# EAGLE design booz_gps (EAGLE 5.04)
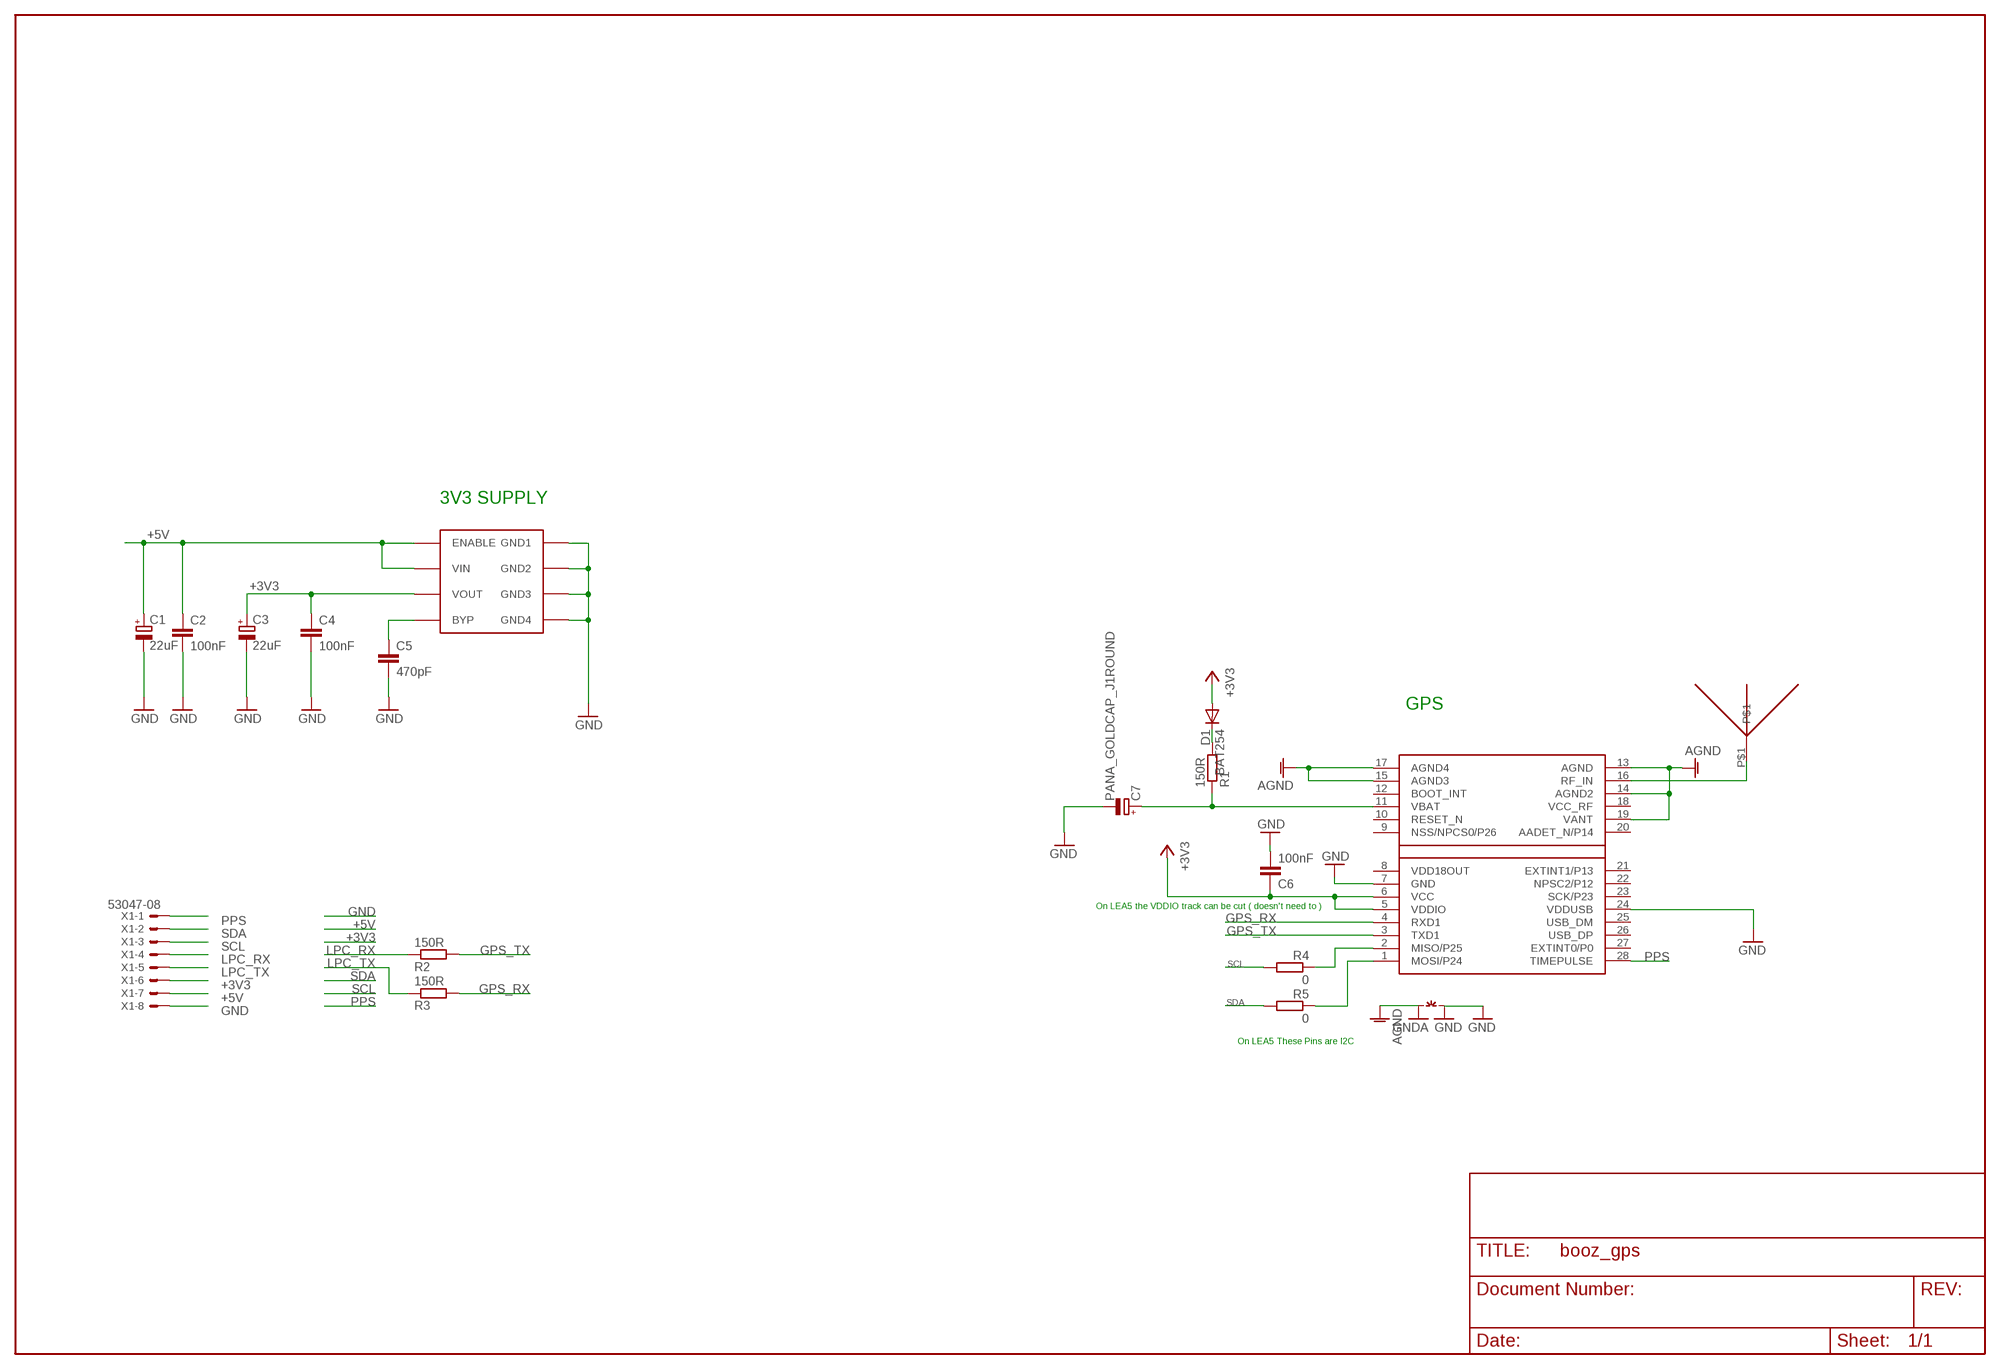
[diagram p0: schematic, sheet 1]

## Parts
ANT  GPS_PATCH_ANT  [SANGSHIN_1580MS18]
C1  22uF  CPOL-EUSMCB  [SMC_B]
C2  100nF  C-EUC0603  [C0603]
C3  22uF  CPOL-EUSMCB  [SMC_B]
C4  100nF  C-EUC0603K  [C0603K]
C5  470pF  C-EUC0603K  [C0603K]
C6  100nF  C-EUC0603K  [C0603K]
C7  PANA_GOLDCAP_J1ROUND  [PANA_J1_BIS]
D1  BAT254  DIODE-SOD110-R  [SOD110-R]
GPS  LEA-4P  [LEA-LA]
R1  150R  R-EU_R0603  [R0603]
R2  150R  R-EU_R0603  [R0603]
R3  150R  R-EU_R0603  [R0603]
R4  0  R-EU_R0603  [R0603]
R5  0  R-EU_R0603  [R0603]
VREG1  MIC5209  [SOIC8]
X1  53047-08  [53047-08]
~NUDEV~1  GND-GNDA  [GND-GNDA]

## Nets
+3V3: C3.+ C4.1 C6.1 D1.A GPS.5(VDDIO) GPS.6(VCC) VREG1.3(VOUT) X1.6
+5V: C1.+ C2.1 VREG1.1(ENABLE) VREG1.2(VIN) X1.7
AGND: GPS.13(AGND) GPS.14(AGND2) GPS.15(AGND3) GPS.17(AGND4) GPS.19(VANT) ~NUDEV~1.GNDA
GND: C1.- C2.2 C3.- C4.2 C5.2 C6.2 C7.MINUS(-) GPS.7(GND) GPS.24(VDDUSB) VREG1.5(GND4) VREG1.6(GND3) VREG1.7(GND2) VREG1.8(GND1) X1.8 ~NUDEV~1.GND
GPS_RX: GPS.4(RXD1) R3.2
GPS_TX: GPS.3(TXD1) R2.2
LPC_RX: R2.1 X1.4
LPC_TX: R3.1 X1.5
N$3: ANT.P$1 GPS.16(RF_IN)
N$6: C5.1 VREG1.4(BYP)
N$10: GPS.2(MISO/P25) R4.1
N$13: GPS.1(MOSI/P24) R5.1
N$28: C7.PLUS(+) GPS.11(VBAT) R1.1
N$29: D1.C R1.2
PPS: GPS.28(TIMEPULSE) X1.1
SCL: R4.2 X1.3
SDA: R5.2 X1.2
Unconnected: GPS.9(NSS/NPCS0/P26) GPS.10(RESET_N) GPS.12(BOOT_INT) GPS.20(AADET_N/P14) GPS.21(EXTINT1/P13) GPS.22(NPSC2/P12) GPS.23(SCK/P23) GPS.25(USB_DM) GPS.26(USB_DP) GPS.27(EXTINT0/P0)

## Notes on the sheet
- 3V3 SUPPLY
- GPS
- On LEA5 the VDDIO track can be cut ( doesn't need to )
- On LEA5 These Pins are I2C

## Power pins joined to a net without a drawn wire
VCC_RF: GPS.18(VCC_RF)
VDD18OUT: GPS.8(VDD18OUT)

## Library data of the parts
ANT = paparazzi:GPS_PATCH_ANT
C1 C3 = rcl:CPOL-EU: POLARIZED CAPACITOR, European symbol
C2 C4-C6 = rcl:C-EU: CAPACITOR, European symbol
C7 = paparazzi:PANA_GOLDCAP_J1
D1 = diode:DIODE-: DIODE
GPS = paparazzi:LEA-4P
R1-R5 = rcl:R-EU_: RESISTOR, European symbol
VREG1 = paparazzi:MIC5209
X1 = con-molex:53?-08: CONNECTOR wire to board 1.25 mm (.049 inch) pitch header
~NUDEV~1 = supply1:GND-GNDA: Example of GND--GNDA NET-Connetor for more info see description in package

## Board
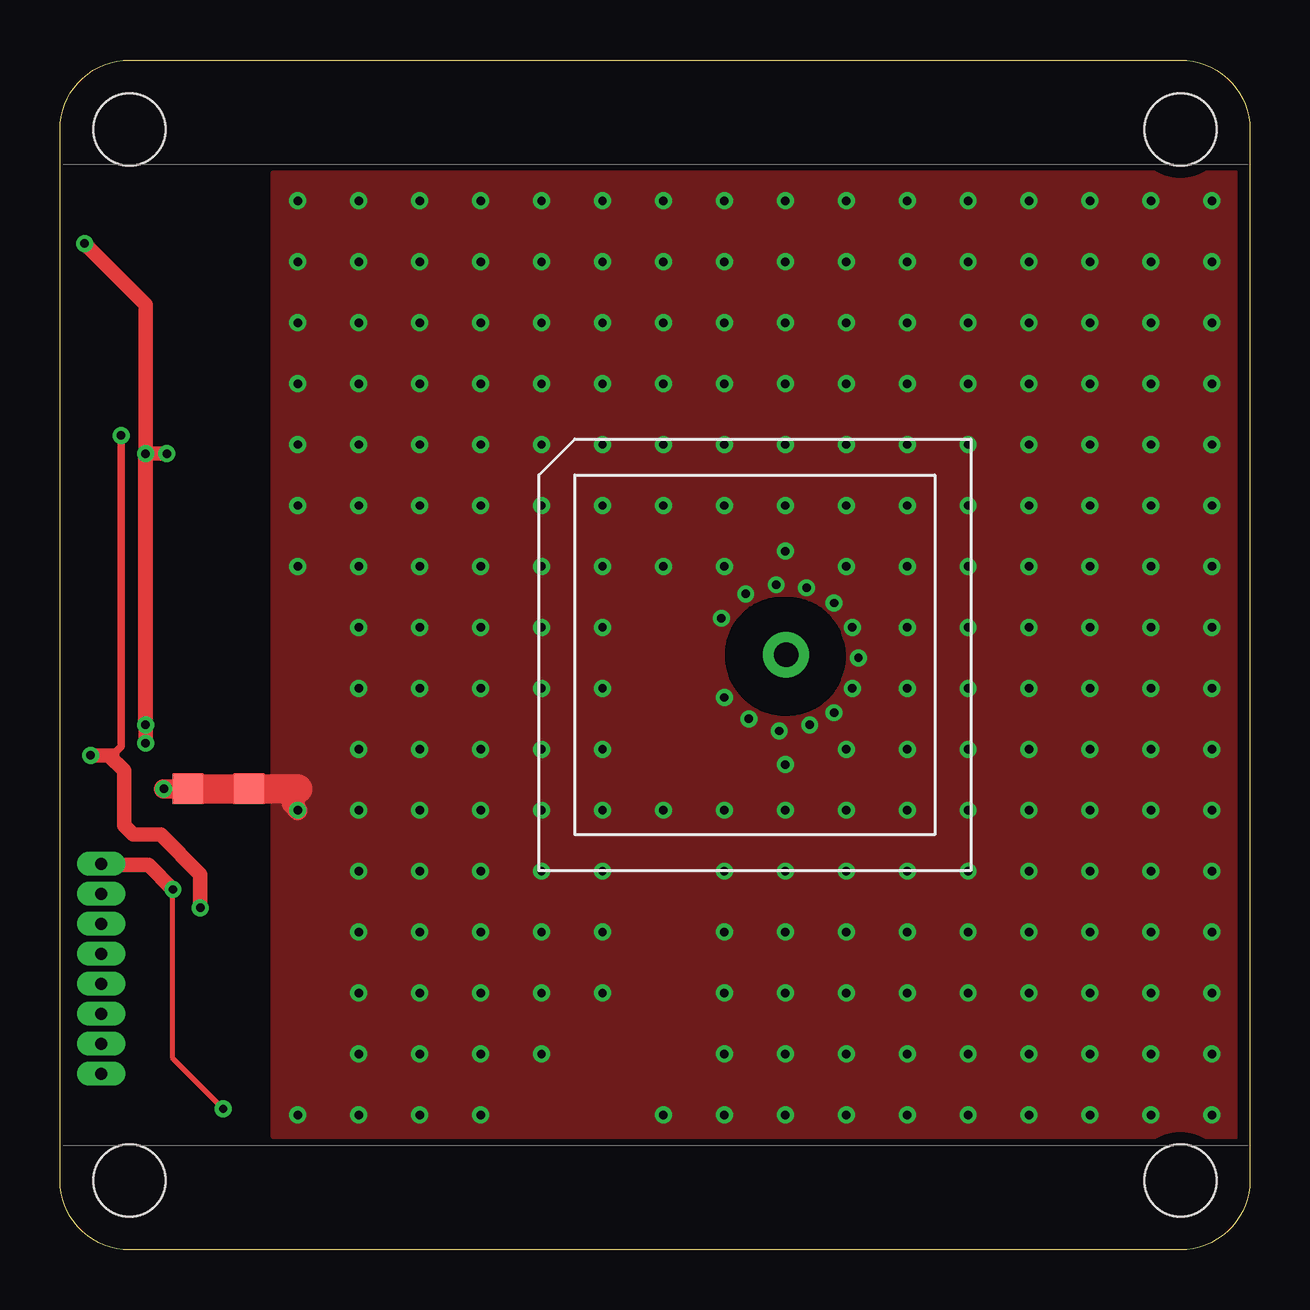
[diagram p1: board, top side]
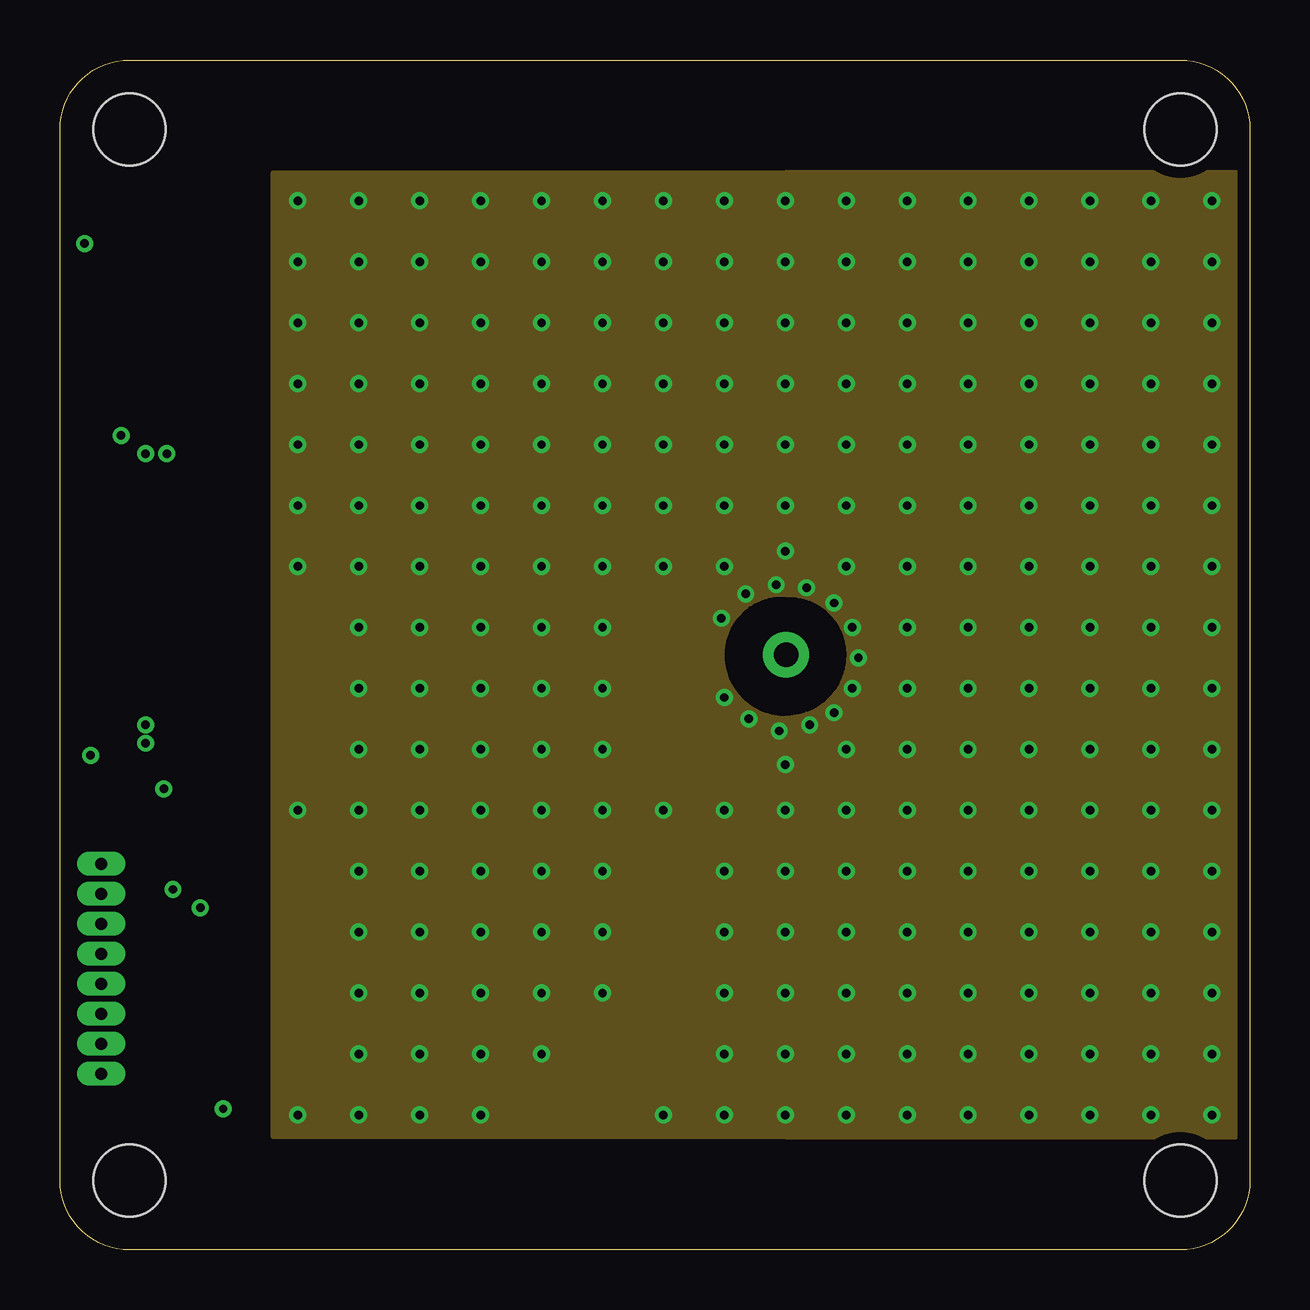
[diagram p2: board, inner layer Route2]
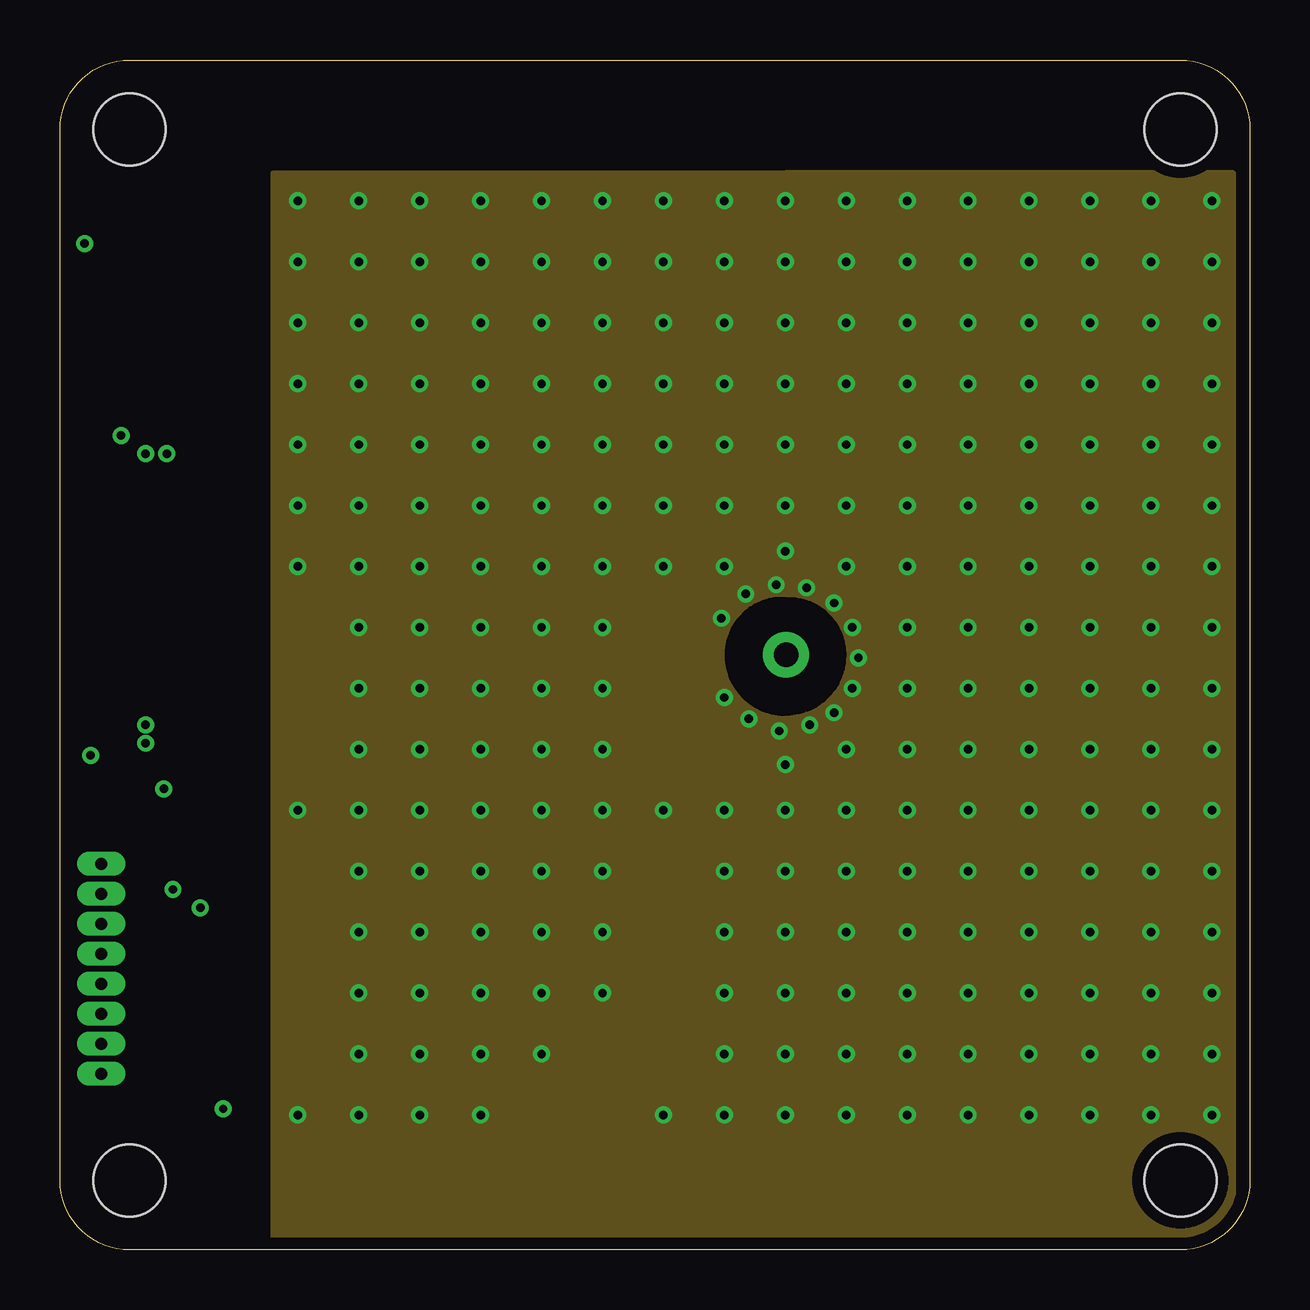
[diagram p3: board, inner layer Route15]
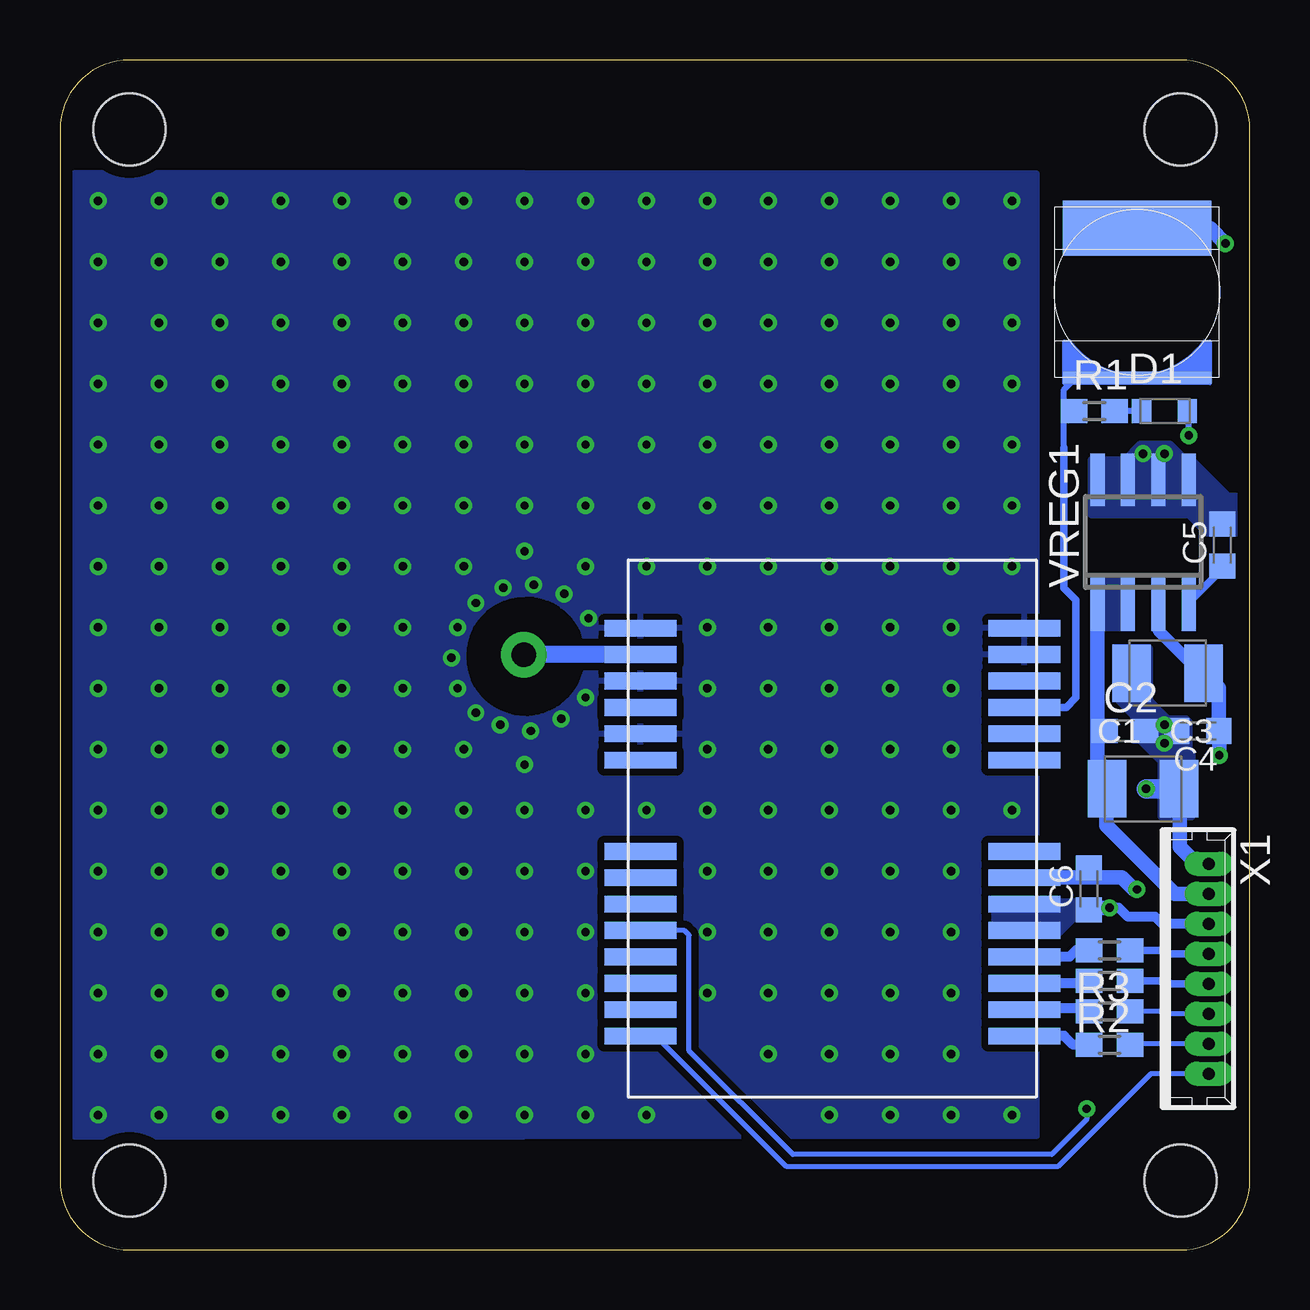
[diagram p4: board, bottom side, seen from below]

Size 49.6 x 49.6 mm. Coordinates in mm from the lower left corner, seen from the top.
Outline: 2.9,49.6 46.7,49.6 arc-90 49.6,46.7 49.6,2.9 arc-90 46.7,0 2.9,0 arc-90 0,2.9 0,46.7 arc-90 2.9,49.6
Copper layers (1*2+15*16): Top 0.035mm / dielectric 0.2mm / Route2 0.035mm / dielectric 1.5mm / Route15 0.035mm / dielectric 0.2mm / Bottom 0.035mm
Design rules "eurocircuits_verified_4l": minimum track width 0.15mm, minimum drill 0.35mm, track to track 0.15mm, track to pad 0.15mm, pad to pad 0.15mm, via to via 0.15mm, smd to smd 0.15mm, copper to edge 20mil, drill to drill 8mil, minimum pad ring 10mil, minimum via ring 7mil, stop-mask expansion 4mil, vias tented up to drill 14mil, thermal gap 10mil
Holes 3 mm at 2.9,46.7 46.7,46.7 46.7,2.9 2.9,2.9
tKeepout: area 0.9,0.9 to 4.9,4.9; area 44.7,0.9 to 48.7,4.9; area 44.7,44.7 to 48.7,48.7; area 0.9,44.7 to 4.9,48.7
bKeepout: area 0.2,0.2 to 5.6,5.6; area 0.2,44 to 5.6,49.4; area 44,0.2 to 49.4,5.6

### Footprints (pad centres in the part's own frame; a part is rotated, then mirrored left to right if it is on the bottom)
SANGSHIN_1580MS18 = drill 1.016 pad 1.905 round: P$1 0,-1.3
SMC_B = smd 1.6 x 2.4: + -1.5,0; - 1.5,0
C0603 = smd 1.1 x 1: 1 -0.85,0; 2 0.85,0
C0603K = smd 1.05 x 1.08: 1 -0.875,0; 2 0.875,0
PANA_J1_BIS = smd 6.2 x 2.3: MINUS 0,-2.794 | smd 6.198 x 0.508: PLUS 0,3.429
SOD110-R = smd 0.8 x 1: A 0.95,0; C -0.95,0
LEA-LA = smd 3 x 0.7: 1 8,-8.65; 2 8,-7.55; 3 8,-6.45; 4 8,-5.35; 5 8,-4.25; 6 8,-3.15; 7 8,-2.05; 8 8,-0.95; 9 8,2.85; 10 8,3.95; 11 8,5.05; 12 8,6.15; 13 8,7.25; 14 8,8.35; 15 -8,8.35; 16 -8,7.25; 17 -8,6.15; 18 -8,5.05; 19 -8,3.95; 20 -8,2.85; 21 -8,-0.95; 22 -8,-2.05; 23 -8,-3.15; 24 -8,-4.25; 25 -8,-5.35; 26 -8,-6.45; 27 -8,-7.55; 28 -8,-8.65
R0603 = smd 1.1 x 1: 1 -0.85,0; 2 0.85,0
SOIC8 = smd 0.6 x 2.2: 1 -1.905,-2.6; 2 -0.635,-2.6; 3 0.635,-2.6; 4 1.905,-2.6; 5 1.905,2.6; 6 0.635,2.6; 7 -0.635,2.6; 8 -1.905,2.6
53047-08 = drill 0.5 pad 0.698 long: 1 4.375,0.45; 2 3.125,0.45; 3 1.875,0.45; 4 0.625,0.45; 5 -0.625,0.45; 6 -1.875,0.45; 7 -3.125,0.45; 8 -4.375,0.45
GND-GNDA = smd 1.27 x 1.27: GND -1.27,0; GNDA 1.27,0

### Placement (x,y rotation side)
ANT  28.96,24.81 90 top
C1  4.45,19.22 0 bottom
C2  5.21,21.63 0 bottom
C3  3.44,24.04 180 bottom
C4  2.17,21.63 180 bottom
C5  1.15,29.38 90 bottom
C6  6.71,15.05 90 bottom
C7  4.71,39.79 180 bottom
D1  3.56,34.97 0 bottom
GPS  17.41,17.57 0 bottom
R1  6.48,34.97 0 bottom
R2  5.85,11.22 180 bottom
R3  5.85,12.49 180 bottom
R4  0/DNP  [R0603]  5.85,9.95 0 bottom
R5  0/DNP  [R0603]  5.85,8.55 0 bottom
VREG1  4.45,29.5 0 bottom
X1  2.17,11.72 270 bottom
~NUDEV~1  6.61,19.22 0 top

### Tracks (layer width: path | path; a pad name or v marks a point on that pad's centre or on a via)
+3V3  (via drill 0.35)
  Top 0.305: v2.55,33.95 2.55,21 2.17,20.61
  Top 0.61: 2.04,20.61 v1.28,20.61 | 2.04,20.61 2.17,20.61 | v5.85,14.26 5.85,15.66 4.2,17.31 3.06,17.31 2.68,17.69 2.68,19.98 2.04,20.61
  Bottom 0.254: D1.A 2.55,34.9 v2.55,33.95
  Bottom 0.305: C3.+ 2.04,24.04
  Bottom 0.406: X1.6 3.66,13.6 3.95,13.88 5.09,13.88 5.47,14.26 v5.85,14.26
  Bottom 0.508: 2.04,24.04 3.82,25.82 VREG1.3
  Bottom 0.61: v1.28,20.61 1.28,21.63 C4.1 1.29,23.42 1.91,24.04 C3.+ | v5.85,14.26 6.74,14.26 6.71,14.24 C6.1 6.71,14.16 6.74,14.14 6.9,14.3
  pour Bottom (isolate 0.127, no thermals): 6.36,14.52 10.68,14.52 10.68,13.12 8.01,13.12 7.25,13.88 6.36,13.88
+5V
  Bottom 0.61: X1.7 3.13,14.85 5.98,17.69 5.98,19.09 C1.+ 5.95,19.11 5.85,19.22 6.36,19.72 6.36,21.63 | 6.36,21.63 6.36,27.73 | 6.36,21.63 C2.1
  pour Bottom (no thermals): 4.96,27.85 6.48,27.85 6.48,25.95 4.96,25.95
AGND  (via drill 0.35)
  Top 0.61: 9.91,19.22 v9.91,18.33
  Top 0.813: v9.91,18.33 9.66,18.58
  Top 1.219: 5.21,19.22 ~NUDEV~1.GNDA 9.91,19.22
  Bottom 0.406: GPS.14 9.63,25.92
  other vias: 9.91,43.73 12.45,43.73 14.99,43.73 17.53,43.73 20.07,43.73 22.61,43.73 25.15,43.73 27.69,43.73 30.23,43.73 32.77,43.73 35.31,43.73 37.85,43.73 40.39,43.73 42.93,43.73 45.47,43.73 48.01,43.73 9.91,41.19 9.91,38.65 9.91,36.11 9.91,33.57 9.91,31.03 9.91,28.49 12.45,28.49 12.45,25.95 12.45,23.41 12.45,20.87 12.45,18.33 12.45,15.79 12.45,13.25 12.45,10.71 12.45,8.17 12.45,5.63 9.91,5.63 14.99,5.63 17.53,5.63 48.01,41.19 48.01,38.65 48.01,36.11 48.01,33.57 48.01,31.03 48.01,28.49 48.01,25.95 48.01,23.41 48.01,20.87 48.01,18.33 48.01,15.79 48.01,13.25 48.01,10.71 48.01,8.17 48.01,5.63 45.47,5.63 42.93,5.63 42.93,8.17 42.93,10.71 40.39,10.71 37.85,10.71 35.31,10.71 32.77,10.71 32.77,8.17 30.23,8.17 27.69,8.17 30.23,10.71 12.45,31.03 12.45,33.57 12.45,36.11 12.45,38.65 12.45,41.19 14.99,41.19 14.99,38.65 14.99,36.11 14.99,33.57 14.99,31.03 14.99,28.49 14.99,25.95 14.99,23.41 14.99,20.87 14.99,18.33 14.99,15.79 14.99,13.25 14.99,10.71 14.99,8.17 17.53,8.17 17.53,10.71 17.53,13.25 17.53,15.79 17.53,18.33 17.53,20.87 17.53,23.41 17.53,25.95 17.53,28.49 17.53,31.03 17.53,33.57 17.53,36.11 17.53,38.65 17.53,41.19 20.07,41.19 22.61,41.19 22.61,38.65 20.07,38.65 20.07,36.11 20.07,33.57 22.61,33.57 22.61,36.11 22.61,31.03 20.07,31.03 20.07,13.25 22.61,10.71 20.07,8.17 25.15,41.19 25.15,38.65 27.69,38.65 27.69,41.19 27.69,36.11 25.15,36.11 30.23,41.19 30.23,38.65 32.77,38.65 32.77,41.19 32.77,36.11 30.23,36.11 35.31,41.19 35.31,38.65 37.85,38.65 37.85,41.19 37.85,36.11 35.31,36.11 40.39,41.19 40.39,38.65 42.93,38.65 42.93,41.19 42.93,36.11 40.39,36.11 45.47,38.65 45.47,41.19 45.47,36.11 45.47,31.03 45.47,33.57 45.47,28.49 40.39,33.57 40.39,31.03 42.93,31.03 42.93,33.57 42.93,28.49 40.39,28.49 35.31,33.57 35.31,31.03 37.85,31.03 37.85,33.57 37.85,28.49 35.31,28.49 30.23,33.57 30.23,31.03 32.77,31.03 32.77,33.57 32.77,28.49 30.23,29.12 25.15,33.57 25.15,31.03 27.69,31.03 27.69,33.57 27.69,28.49 25.15,28.49 20.07,28.49 20.07,25.95 22.61,25.95 22.61,28.49 22.61,23.41 20.07,23.41 20.07,20.87 20.07,18.33 22.61,18.33 22.61,20.87 22.61,15.79 20.07,15.79 30.23,18.33 30.23,15.79 32.77,15.79 32.77,18.33 32.77,13.25 30.23,13.25 27.69,18.33 35.31,25.95 35.31,23.41 37.85,23.41 37.85,25.95 37.85,20.87 35.31,20.87 32.77,20.87 30.23,20.23 40.39,25.95 40.39,23.41 42.93,23.41 42.93,25.95 42.93,20.87 40.39,20.87 45.47,20.87 45.47,23.41 45.47,18.33 45.47,25.95 45.47,13.25 45.47,15.79 45.47,10.71 45.47,8.17 40.39,18.33 40.39,15.79 42.93,15.79 42.93,18.33 42.93,13.25 40.39,13.25 35.31,18.33 35.31,15.79 37.85,15.79 37.85,18.33 37.85,13.25 35.31,13.25 27.57,26.33 28.58,27.35 29.85,27.73 31.12,27.6 32.27,26.96 33.03,25.95 33.28,24.68 33.03,23.41 32.27,22.39 31.25,21.88 29.98,21.63 28.71,22.14 27.69,23.03 27.69,15.79 27.69,13.25 27.69,10.71 25.15,18.33 22.61,13.25 20.07,10.71 40.39,8.17 37.85,8.17 35.31,8.17 40.39,5.63 37.85,5.63 35.31,5.63 32.77,5.63 30.23,5.63 27.69,5.63 25.15,5.63
  pour Bottom (isolate 0.305): 30.23,22.14 arc-90 27.57,24.81 arc-90 30.23,27.35 30.23,44.87 8.9,44.87 8.9,4.74 30.23,4.74
  pour Bottom (isolate 0.305): 30.23,22.14 arc90 32.77,24.68 32.77,24.81 arc90 30.23,27.35 30.23,44.87 49.03,44.87 49.03,4.74 30.23,4.74
  pour Top (isolate 0.254): 8.9,44.87 30.23,44.87 30.23,27.35 30.11,27.35 arc90 27.57,24.81 arc90 30.23,22.14 30.23,4.74 8.9,4.74
  pour Top (isolate 0.254): 30.23,44.87 49.03,44.87 49.03,4.74 30.23,4.74 30.23,22.14 arc90 32.9,24.68 32.9,24.81 arc90 30.23,27.35
  pour Route2 (isolate 0.254): 30.23,27.35 30.36,27.35 arc-90 32.9,24.81 arc-90 30.23,22.14 30.23,4.74 33.28,4.74 49.03,4.74 49.03,14.64 49.03,44.87 35.31,44.87 30.23,44.87
  pour Route2 (isolate 0.254): 30.23,27.35 30.11,27.35 arc90 27.57,24.81 arc90 30.23,22.14 30.23,4.74 27.44,4.74 8.9,4.74 8.9,24.81 8.9,44.87 30.23,44.87
  pour Route15 (isolate 0.254): 8.9,44.87 30.23,44.87 30.23,27.35 30.11,27.35 arc90 27.57,24.81 arc90 30.23,22.14 30.23,0.42 8.9,0.42
  pour Route15 (isolate 0.254): 30.23,0.42 48.9,0.42 48.9,44.87 30.23,44.87 30.23,27.35 30.36,27.35 arc-90 32.9,24.81 arc-90 30.23,22.14
GND  (via drill 0.35)
  Top 0.203: v4.71,15.03 4.71,7.98 v6.8,5.88
  Top 0.61: v3.56,21.12 v3.56,21.88 | 1.66,16.04 X1.8 1.77,16.04 3.69,16.04 v4.71,15.03 | v4.45,33.19 v3.56,33.19 3.56,39.41 v1.02,41.95
  Top 0.635: v3.56,21.88 v3.56,33.19
  Top 0.813: v4.33,19.22 ~NUDEV~1.GND
  Bottom 0.203: GPS.24 23.57,13.32 23.38,13.12 23.38,8.3 19.06,3.98 8.26,3.98 6.8,5.44 v6.8,5.88
  Bottom 0.61: VREG1.6 3.82,32.55 | v1.02,41.95 1.66,42.58 C7.MINUS | C1.- 2.93,19.09 2.93,19.22 2.93,16.8 2.22,16.1 X1.8 | GPS.7 9.39,15.53 6.61,15.53 | 6.61,15.53 5.34,15.53 4.83,15.03 v4.71,15.03 | C6.2 6.71,15.63 6.61,15.53 | X1.8 | X1.8 1.66,16.04
  Bottom 0.813: 2.93,19.22 v4.33,19.22
  pour Bottom (no thermals): 6.61,32.93 6.61,30.65 2.55,30.65 1.79,29.89 0.52,29.89 0.52,31.41 0.9,31.41 2.42,32.93 2.68,32.93 3.31,33.57 4.58,33.57 5.21,32.93
  pour Bottom (no thermals): 2.42,18.07 2.42,20.74 2.55,20.87 2.55,22.01 2.68,22.14 3.44,22.14 4.2,22.9 4.2,25.06 5.6,25.06 5.6,23.03 4.83,22.27 4.83,21.25 4.58,21.25 3.69,20.36 3.69,18.07
GPS_RX
  Bottom 0.406: GPS.4 7.52,12.22 7.25,12.49 R3.2
GPS_TX
  Bottom 0.406: R2.2 6.48,11.22 6.59,11.12 GPS.3
LPC_RX
  Bottom 0.305: X1.4 3.32,11.1 3.44,11.22 R2.1
  Bottom 0.406: R2.1 5.06,11.25 5.11,11.2
LPC_TX
  Bottom 0.305: R3.1 5.01,12.49 5,12.5 | X1.5 3.43,12.35 3.56,12.49 R3.1 | R3.1 5.34,12.49 5.33,12.5 5.3,12.5
  Bottom 0.406: 5.3,12.5
N$3
  Bottom 0.711: ANT.P$1 30.23,24.81 30.23,24.82 GPS.16
N$6
  Bottom 0.305: 1.15,28.61 C5.1 1.15,28.38 2.55,26.98 VREG1.4
N$10
  Bottom 0.254: 6.61,10.03 6.61,10.07
  Bottom 0.406: R4.1 6.61,10.03 | GPS.2 9.35,10.07 6.61,10.07
N$13
  Bottom 0.254: GPS.1
  Bottom 0.406: R5.1 7.37,8.55 7.75,8.93 GPS.1
N$28
  Bottom 0.254: 7.75,33.44 7.75,34.58 7.37,34.97 R1.1 7.75,34.97 7.75,35.85 7.25,36.36 C7.PLUS
  Bottom 0.305: GPS.11 7.66,22.62 7.25,23.03 7.25,27.09 7.75,27.6 7.75,33.44
N$29
  Bottom 0.254: 5.85,34.97 R1.2 D1.C
PPS
  Bottom 0.203: X1.1 4.13,7.35 8.01,3.47 19.31,3.47 24.77,8.93 24.9,8.93
  Bottom 0.254: 24.9,8.93 GPS.28
  Bottom 0.305: GPS.28
SCL
  Bottom 0.203: X1.3 3.34,9.85 3.44,9.95 R4.2
  Bottom 0.254: R4.2 5.21,9.95
SDA
  Bottom 0.203: X1.2 4.91,8.6
  Bottom 0.305: R5.2 4.96,8.55 4.91,8.6

### Text on the board
tDocu: Quadrotor GPS V1.1 | 2009/5 | GND | +5V | +3V3 | GPS_RX | GPS_TX | SCL | SDA | PPS